# EAGLE design scroogemote (EAGLE 5.12)
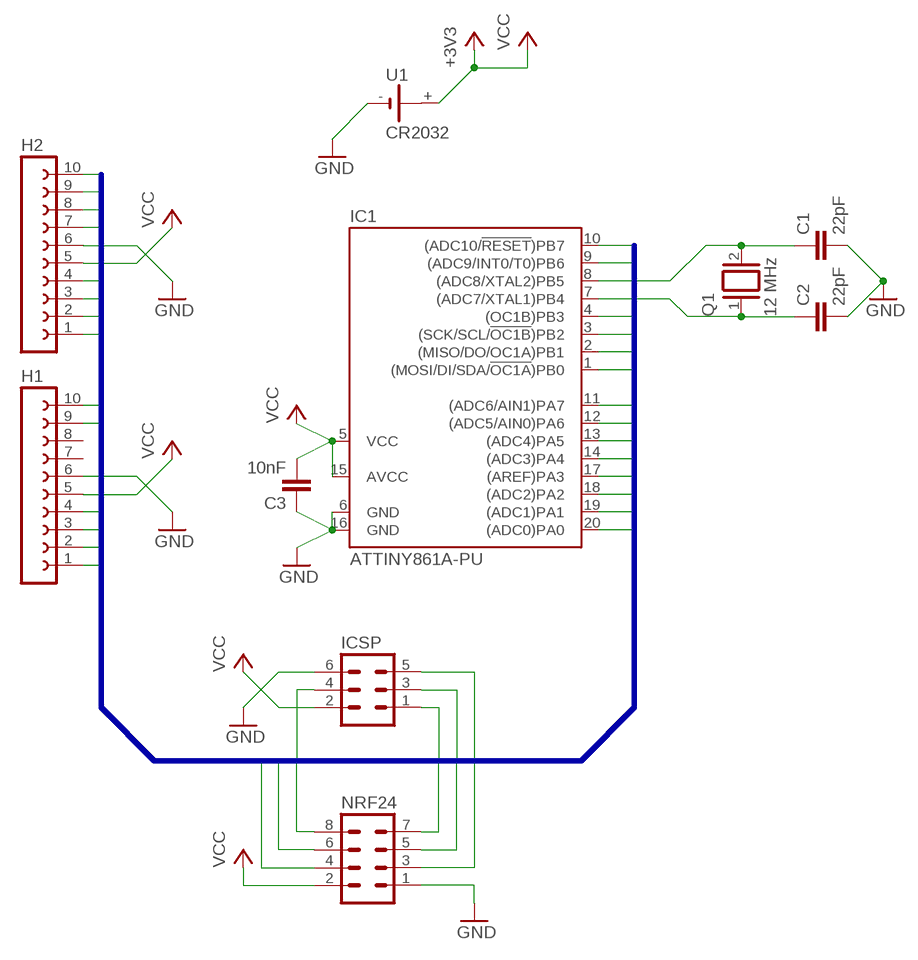
[diagram p0: schematic, sheet 1]

## Parts
C1  22pF  C2.5/2  [C2.5-2]
C2  22pF  C2.5/2  [C2.5-2]
C3  10nF  C2.5/2  [C2.5-2]
H1  FE10-1  [FE10]
H2  FE10-1  [FE10]
IC1  ATTINY861A-PU  TINY26LP  [DIL20]
ICSP  MA03-2  [MA03-2]
NRF24  MA04-2  [MA04-2]
Q1  12 MHz  XTAL/S  [QS]
U1  CR2032  2032_V_SMALL  [V2032_THIN]

## Nets
GND [supply]: C1.2 C2.2 C3.1 H1.6 H2.6 IC1.6(GND) IC1.16(GND) ICSP.6 NRF24.1 U1.-
MISO: H1.2 IC1.2((MISO/DO/OC1A)PB1) ICSP.1 NRF24.7
MOSI: H1.1 IC1.1((MOSI/DI/SDA/!OC1A!)PB0) ICSP.4 NRF24.6
N$1: C2.1 IC1.7((ADC7/XTAL1)PB4) Q1.1
N$2: C1.1 IC1.8((ADC8/XTAL2)PB5) Q1.2
NRESET: H1.10 IC1.10((ADC10/!RESET!)PB7) ICSP.5
PA0: H2.10 IC1.20((ADC0)PA0) NRF24.3
PA1: H2.9 IC1.19((ADC1)PA1) NRF24.4
PA2: H2.8 IC1.18((ADC2)PA2)
PA3: H2.7 IC1.17((AREF)PA3)
PA4: H2.4 IC1.14((ADC3)PA4)
PA5: H2.3 IC1.13((ADC4)PA5)
PA6: H2.2 IC1.12((ADC5/AIN0)PA6)
PA7: H2.1 IC1.11((ADC6/AIN1)PA7)
PB3: H1.4 IC1.4((OC1B)PB3)
PB6: H1.9 IC1.9((ADC9/INT0/T0)PB6) NRF24.8
SCK: H1.3 IC1.3((SCK/SCL/!OC1B!)PB2) ICSP.3 NRF24.5
VCC [supply]: C3.2 H1.5 H2.5 IC1.5(VCC) IC1.15(AVCC) ICSP.2 NRF24.2 U1.+ ; supply symbol labelled +3V3
Unconnected: H1.7 H1.8 U1.+@1(+)

## Buses
PA[0..7],PB[0..7]

## Library data of the parts
C1-C3 = capacitor-wima:C: CAPACITOR naming: grid - package width
H1 H2 = con-lsta:FE10-1: FEMALE HEADER; OC_FARNELL: unknown; OC_NEWARK: unknown
IC1 = atmel:TINY26*: 8-bit AVR Microcontroller with 2K Bytes Flash Source: http://www.atmel.com .. doc1477.pdf; MPN: ATTINY26L-8PU; OC_FARNELL: 9171657; OC_NEWARK: 01M6920
ICSP = con-lstb:MA03-2: PIN HEADER; OC_FARNELL: unknown; OC_NEWARK: unknown
NRF24 = con-lstb:MA04-2: PIN HEADER; OC_FARNELL: unknown; OC_NEWARK: unknown
Q1 = special:XTAL/S: CRYSTAL
U1 = coin_cell:2032_V_SMALL

## Net classes
0 default: width 0.203 mm, clearance 0.203 mm
1 supply: width 0.406 mm, clearance 0.203 mm

## Board
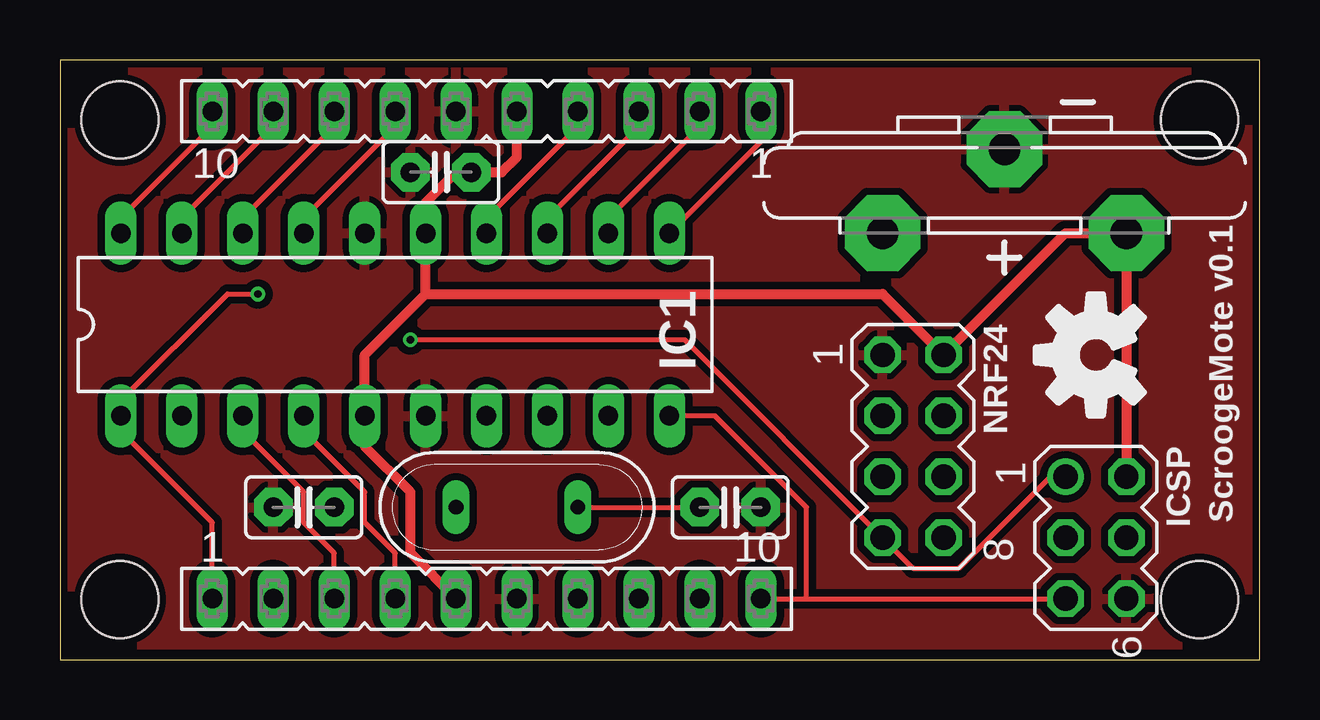
[diagram p1: board, top side]
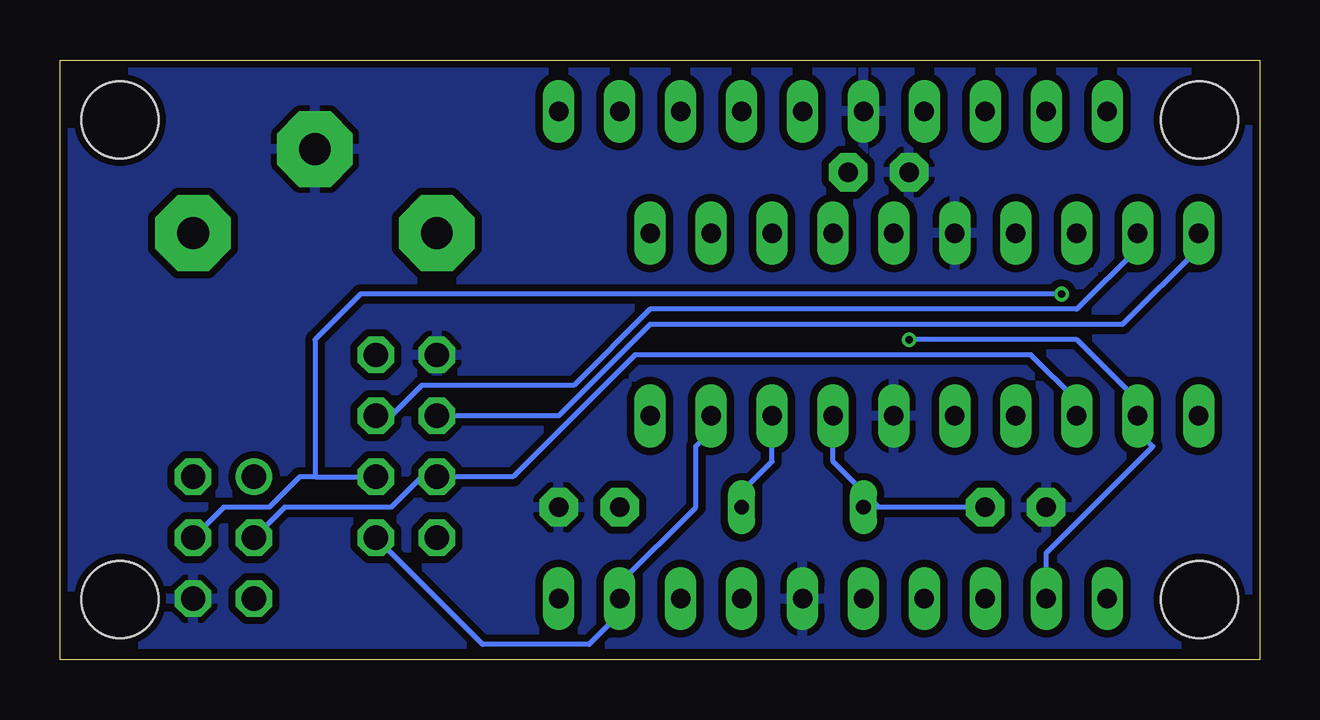
[diagram p2: board, bottom side, seen from below]

Size 50 x 25 mm. Coordinates in mm from the lower left corner, seen from the top.
Outline: 0,0 50,0 50,25 0,25 0,0
Copper layers (1*16): Top 0.035mm / dielectric 1.5mm / Bottom 0.035mm
Design rules "ITEADstudio_DRC *": minimum track width 6mil, minimum drill 12mil, track to track 6mil, track to pad 6mil, pad to pad 6mil, via to via 6mil, smd to smd 0mil, copper to edge 10mil, drill to drill 10mil, minimum pad ring 10mil, minimum via ring 6mil, stop-mask expansion 2mil, vias tented up to drill 100mil, thermal gap 10mil
Holes 3.2 mm at 2.5,2.5 47.5,2.5 47.5,22.5 2.5,22.5

### Footprints (pad centres in the part's own frame; a part is rotated, then mirrored left to right if it is on the bottom)
C2.5-2 = drill 0.813 pad 1.6 octagon: 1 -1.27,0; 2 1.27,0
FE10 = drill 0.813 long: 1 -11.43,0; 2 -8.89,0; 3 -6.35,0; 4 -3.81,0; 5 -1.27,0; 6 1.27,0; 7 3.81,0; 8 6.35,0; 9 8.89,0; 10 11.43,0
DIL20 = drill 0.813 long: 1 -11.43,-3.81; 2 -8.89,-3.81; 3 -6.35,-3.81; 4 -3.81,-3.81; 5 -1.27,-3.81; 6 1.27,-3.81; 7 3.81,-3.81; 8 6.35,-3.81; 9 8.89,-3.81; 10 11.43,-3.81; 11 11.43,3.81; 12 8.89,3.81; 13 6.35,3.81; 14 3.81,3.81; 15 1.27,3.81; 16 -1.27,3.81; 17 -3.81,3.81; 18 -6.35,3.81; 19 -8.89,3.81; 20 -11.43,3.81
MA03-2 = drill 1.016 round: 1 -2.54,-1.27 | drill 1.016 octagon: 2 -2.54,1.27; 3 0,-1.27; 4 0,1.27; 5 2.54,-1.27; 6 2.54,1.27
MA04-2 = drill 1.016 octagon: 1 -3.81,-1.27; 2 -3.81,1.27; 3 -1.27,-1.27; 4 -1.27,1.27; 5 1.27,-1.27; 6 1.27,1.27; 7 3.81,-1.27; 8 3.81,1.27
QS = drill 0.61 long: 1 -2.54,0; 2 2.54,0
V2032_THIN = drill 1.321 pad 3.15 octagon: + 1.27,-5.08; +@1 1.27,5.08; - 4.771,0

### Placement (x,y rotation side)
C1  27.94,6.35 0 top
C2  10.16,6.35 180 top
C3  15.88,20.32 0 top
H1  17.78,2.54 0 top
H2  17.78,22.86 180 top
IC1  13.97,13.97 0 top
ICSP  43.18,5.08 270 top
NRF24  35.56,8.89 270 top
Q1  19.05,6.35 0 top
U1  39.37,16.51 90 top

### Tracks (layer width: path | path; a pad name or v marks a point on that pad's centre or on a via)
GND
  pour Bottom (isolate 0.305): 0,0.64 49.97,0.64 49.97,24.96 0,24.96
  pour Top (isolate 0.305): 0,0.64 49.97,0.64 49.97,24.96 0,24.96
MISO  (via drill 0.3)
  Top 0.203: ICSP.1 41.27,7.62 37.47,3.81 35.56,3.81 NRF24.7 26.04,13.34 v14.61,13.34
  Bottom 0.203: H1.2 8.89,4.45 4.45,8.89 5.08,9.53 IC1.2 5.08,10.79 7.62,13.34 v14.61,13.34
MOSI  (via drill 0.3)
  Top 0.203: H1.1 6.35,5.71 2.54,9.53 IC1.1 2.54,10.79 6.99,15.24 v8.26,15.24
  Bottom 0.203: 39.37,7.62 40.01,7.62 41.27,6.35 43.18,6.35 ICSP.4 | 39.37,7.62 NRF24.6 | 39.37,7.62 39.37,13.34 37.47,15.24 v8.26,15.24
N$1
  Bottom 0.203: C2.1 15.88,6.35 | 15.88,6.35 Q1.1 | IC1.7 17.78,8.26 15.88,6.35
N$2
  Top 0.203: Q1.2 C1.1
  Bottom 0.203: IC1.8 20.32,8.26 21.59,6.99 Q1.2
NRESET
  Top 0.203: 31.11,2.54 ICSP.5 | H1.10 31.11,2.54 | IC1.10 27.3,10.16 31.11,6.35 31.11,2.54
PA0
  Top 0.203: IC1.20 2.54,18.41 6.35,22.23 H2.10
  Bottom 0.203: NRF24.3 29.21,10.16 25.4,13.97 5.71,13.97 2.54,17.14 IC1.20
PA1
  Top 0.203: IC1.19 5.08,18.41 8.89,22.23 H2.9
  Bottom 0.203: NRF24.4 36.2,10.16 34.92,11.43 28.57,11.43 25.4,14.61 7.62,14.61 5.08,17.14 IC1.19
PA2
  Top 0.203: IC1.18 7.62,18.41 11.43,22.23 H2.8
PA3
  Top 0.203: IC1.17 10.16,18.41 13.97,22.23 H2.7
PA4
  Top 0.203: IC1.14 17.78,18.41 21.59,22.23 H2.4
PA5
  Top 0.203: IC1.13 20.32,18.41 24.13,22.23 H2.3
PA6
  Top 0.203: IC1.12 22.86,18.41 26.67,22.23 H2.2
PA7
  Top 0.203: IC1.11 29.21,21.59 H2.1
PB3
  Top 0.203: H1.4 13.97,4.45 12.7,5.71 12.7,6.99 10.16,9.53 IC1.4
PB6
  Bottom 0.203: IC1.9 22.86,9.53 23.5,8.89 23.5,6.35 26.67,3.17 H1.9 26.67,1.91 27.94,0.64 32.38,0.64 NRF24.8
SCK
  Top 0.203: H1.3 11.43,4.45 10.16,5.71 10.16,6.99 7.62,9.53 IC1.3
  Bottom 0.203: ICSP.3 40.64,6.35 36.2,6.35 34.92,7.62 NRF24.5 31.11,7.62 26.04,12.7 9.53,12.7 7.62,10.79 IC1.3
VCC
  Top 0.406: ICSP.2 U1.+ 41.91,17.78 NRF24.2 34.29,15.24 15.24,15.24 | H2.5 19.05,20.95 18.41,20.32 C3.2 16.51,20.32 15.24,19.05 IC1.15 15.24,15.24 | H1.5 14.61,4.45 14.61,6.99 12.7,8.89 IC1.5 12.7,12.7 15.24,15.24

### Text on the board
tNames: ScroogeMote v0.1